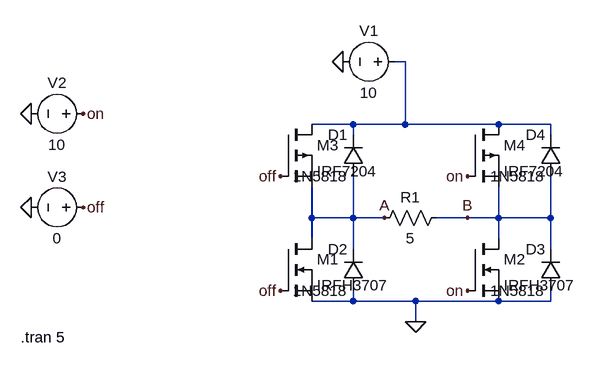
[diagram p0: schematic Draft1.asc]
Draft1.asc, the LTspice schematic file:
Version 4.1
SHEET 1 880 680
WIRE 288 -64 272 -64
WIRE 208 32 144 32
WIRE 288 32 288 -64
WIRE 288 32 208 32
WIRE 432 32 288 32
WIRE 512 32 432 32
WIRE 208 48 208 32
WIRE 512 48 512 32
WIRE 144 176 144 128
WIRE 208 176 208 112
WIRE 208 176 144 176
WIRE 256 176 208 176
WIRE 384 176 336 176
WIRE 432 176 432 128
WIRE 432 176 384 176
WIRE 512 176 512 112
WIRE 512 176 432 176
WIRE 144 208 144 176
WIRE 432 208 432 176
WIRE 208 224 208 176
WIRE 512 224 512 176
WIRE 208 304 208 288
WIRE 208 304 144 304
WIRE 304 304 208 304
WIRE 432 304 304 304
WIRE 512 304 512 288
WIRE 512 304 432 304
WIRE 304 336 304 304
FLAG 256 176 A
FLAG 384 176 B
FLAG 192 -64 0
FLAG 304 336 0
FLAG -288 16 0
FLAG -208 16 on
FLAG -288 160 0
FLAG -208 160 off
FLAG 384 112 on
FLAG 384 288 on
FLAG 96 112 off
FLAG 96 288 off
SYMBOL nmos 96 208 R0
SYMATTR InstName M1
SYMATTR Value IRFH3707
SYMBOL nmos 384 208 R0
SYMATTR InstName M2
SYMATTR Value IRFH3707
SYMBOL pmos 96 32 R0
SYMATTR InstName M3
SYMATTR Value IRF7204
SYMBOL pmos 384 32 R0
SYMATTR InstName M4
SYMATTR Value IRF7204
SYMBOL voltage 288 -64 R90
WINDOW 0 -32 56 VBottom 2
WINDOW 3 32 56 VTop 2
WINDOW 123 0 0 Left 0
WINDOW 39 0 0 Left 0
SYMATTR InstName V1
SYMATTR Value 10
SYMBOL voltage -192 16 R90
WINDOW 0 -32 56 VBottom 2
WINDOW 3 32 56 VTop 2
WINDOW 123 0 0 Left 0
WINDOW 39 0 0 Left 0
SYMATTR InstName V2
SYMATTR Value 10
SYMBOL voltage -192 160 R90
WINDOW 0 -32 56 VBottom 2
WINDOW 3 32 56 VTop 2
WINDOW 123 0 0 Left 0
WINDOW 39 0 0 Left 0
SYMATTR InstName V3
SYMATTR Value 0
SYMBOL res 352 160 R90
WINDOW 0 0 56 VBottom 2
WINDOW 3 32 56 VTop 2
SYMATTR InstName R1
SYMATTR Value 5
SYMBOL diode 224 112 R180
WINDOW 0 24 64 Left 2
WINDOW 3 24 0 Left 2
SYMATTR InstName D1
SYMATTR Value 1N5818
SYMATTR Description Diode
SYMATTR Type diode
SYMBOL diode 224 288 R180
WINDOW 0 24 64 Left 2
WINDOW 3 24 0 Left 2
SYMATTR InstName D2
SYMATTR Value 1N5818
SYMATTR Description Diode
SYMATTR Type diode
SYMBOL diode 528 288 R180
WINDOW 0 24 64 Left 2
WINDOW 3 24 0 Left 2
SYMATTR InstName D3
SYMATTR Value 1N5818
SYMATTR Description Diode
SYMATTR Type diode
SYMBOL diode 528 112 R180
WINDOW 0 24 64 Left 2
WINDOW 3 24 0 Left 2
SYMATTR InstName D4
SYMATTR Value 1N5818
SYMATTR Description Diode
SYMATTR Type diode
TEXT -304 360 Left 2 !.tran 5

The netlist it stands for:
* Draft1.asc
M1 A off 0 0 IRFH3707
M2 B on 0 0 IRFH3707
M3 N001 off A A IRF7204
M4 N001 on B B IRF7204
V1 N001 0 10
V2 on 0 10
V3 off 0 0
R1 B A 5
D1 A N001 1N5818
D2 0 A 1N5818
D3 0 B 1N5818
D4 B N001 1N5818
.model D D
.lib standard.dio
.model NMOS NMOS
.model PMOS PMOS
.lib standard.mos
.tran 5
.backanno
.end